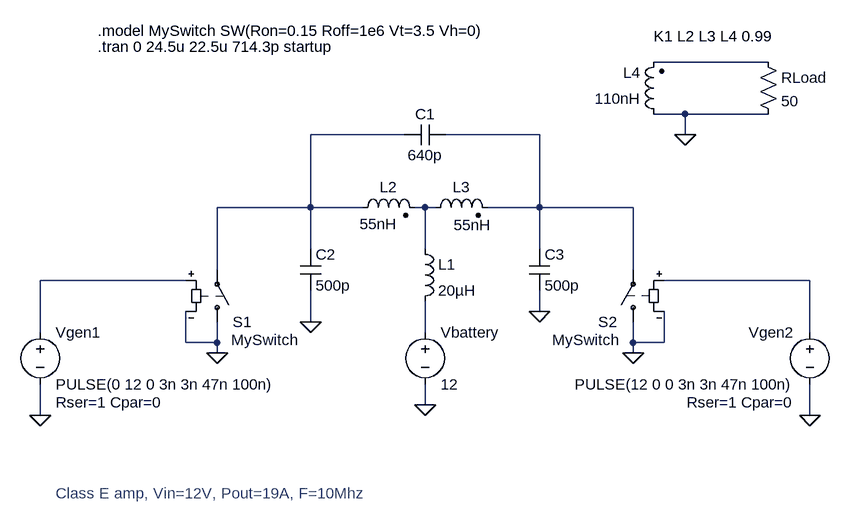
[diagram p0: schematic classe-pushpull-10Mhz-tuned.asc]
classe-pushpull-10Mhz-tuned.asc, the LTspice schematic file:
Version 4
SHEET 1 1364 344
WIRE 1120 -336 944 -336
WIRE 992 -256 944 -256
WIRE 1120 -256 992 -256
WIRE 560 -224 416 -224
WIRE 768 -224 624 -224
WIRE 992 -224 992 -256
WIRE 416 -112 416 -224
WIRE 416 -112 272 -112
WIRE 496 -112 416 -112
WIRE 592 -112 576 -112
WIRE 608 -112 592 -112
WIRE 768 -112 768 -224
WIRE 768 -112 688 -112
WIRE 912 -112 768 -112
WIRE 416 -48 416 -112
WIRE 592 -48 592 -112
WIRE 768 -48 768 -112
WIRE 272 -16 272 -112
WIRE 912 -16 912 -112
WIRE 224 0 0 0
WIRE 1184 0 960 0
WIRE 768 48 768 16
WIRE 416 64 416 16
WIRE 0 80 0 0
WIRE 592 80 592 32
WIRE 1184 80 1184 0
WIRE 224 96 224 48
WIRE 272 96 272 64
WIRE 272 96 224 96
WIRE 912 96 912 64
WIRE 960 96 960 48
WIRE 960 96 912 96
WIRE 272 112 272 96
WIRE 912 112 912 96
WIRE 592 192 592 160
WIRE 0 208 0 160
WIRE 1184 208 1184 160
FLAG 0 208 0
FLAG 272 112 0
FLAG 592 192 0
FLAG 416 64 0
FLAG 1184 208 0
FLAG 912 112 0
FLAG 768 48 0
FLAG 992 -224 0
SYMBOL voltage 592 64 R0
WINDOW 123 24 132 Left 2
WINDOW 39 0 0 Left 2
SYMATTR InstName Vbattery
SYMATTR Value 12
SYMBOL voltage 0 64 R0
WINDOW 123 24 132 Left 2
WINDOW 39 24 124 Left 2
SYMATTR SpiceLine Rser=1 Cpar=0
SYMATTR InstName Vgen1
SYMATTR Value PULSE(0 12 0 3n 3n 47n 100n)
SYMBOL ind 576 -64 R0
SYMATTR InstName L1
SYMATTR Value 20µH
SYMATTR SpiceLine Rser=0.5
SYMBOL cap 400 -48 R0
SYMATTR InstName C2
SYMATTR Value 500p
SYMBOL cap 624 -240 R90
WINDOW 0 0 32 VBottom 2
WINDOW 3 32 32 VTop 2
SYMATTR InstName C1
SYMATTR Value 640p
SYMBOL ind2 480 -96 R270
WINDOW 0 32 56 VTop 2
WINDOW 3 6 40 VBottom 2
SYMATTR InstName L2
SYMATTR Value 55nH
SYMATTR Type ind
SYMATTR SpiceLine Rser=0.045
SYMBOL res 1104 -352 R0
SYMATTR InstName RLoad
SYMATTR Value 50
SYMBOL sw 272 80 M180
WINDOW 3 22 -12 Left 2
SYMATTR Value MySwitch
SYMATTR InstName S1
SYMBOL voltage 1184 64 M0
WINDOW 123 24 132 Left 2
WINDOW 39 24 124 Left 2
SYMATTR SpiceLine Rser=1 Cpar=0
SYMATTR InstName Vgen2
SYMATTR Value PULSE(12 0 0 3n 3n 47n 100n)
SYMBOL sw 912 80 R180
WINDOW 3 22 -12 Left 2
SYMATTR Value MySwitch
SYMATTR InstName S2
SYMBOL ind2 592 -96 R270
WINDOW 0 32 56 VTop 2
WINDOW 3 5 73 VBottom 2
SYMATTR InstName L3
SYMATTR Value 55nH
SYMATTR Type ind
SYMATTR SpiceLine Rser=0.045
SYMBOL cap 752 -48 R0
SYMATTR InstName C3
SYMATTR Value 500p
SYMBOL ind2 960 -240 R180
WINDOW 0 36 80 Left 2
WINDOW 3 36 40 Left 2
SYMATTR InstName L4
SYMATTR Value 110nH
SYMATTR Type ind
SYMATTR SpiceLine Rser=0.05
TEXT 88 -360 Left 2 !.tran 0 24.5u 22.5u 714.3p startup
TEXT 88 -384 Left 2 !.model MySwitch SW(Ron=0.15 Roff=1e6 Vt=3.5 Vh=0)
TEXT 24 328 Left 2 ;Class E amp, Vin=12V, Pout=19A, F=10Mhz
TEXT 944 -376 Left 2 !K1 L2 L3 L4 0.99

The netlist it stands for:
* classe-pushpull-10Mhz-tuned.asc
Vbattery N007 0 12
Vgen1 N005 0 PULSE(0 12 0 3n 3n 47n 100n) Rser=1 Cpar=0
L1 N004 N007 20µH Rser=0.5
C2 N002 0 500p
C1 N003 N002 640p
L2 N002 N004 55nH Rser=0.045
RLoad N001 0 50
S1 0 N002 N005 0 MySwitch
Vgen2 N006 0 PULSE(12 0 0 3n 3n 47n 100n) Rser=1 Cpar=0
S2 0 N003 N006 0 MySwitch
L3 N004 N003 55nH Rser=0.045
C3 N003 0 500p
L4 0 N001 110nH Rser=0.05
.tran 0 24.5u 22.5u 714.3p startup
.model MySwitch SW(Ron=0.15 Roff=1e6 Vt=3.5 Vh=0)
* Class E amp, Vin=12V, Pout=19A, F=10Mhz
K1 L2 L3 L4 0.99
.backanno
.end